# Altium project DD_Current_Sensing.PrjPcb
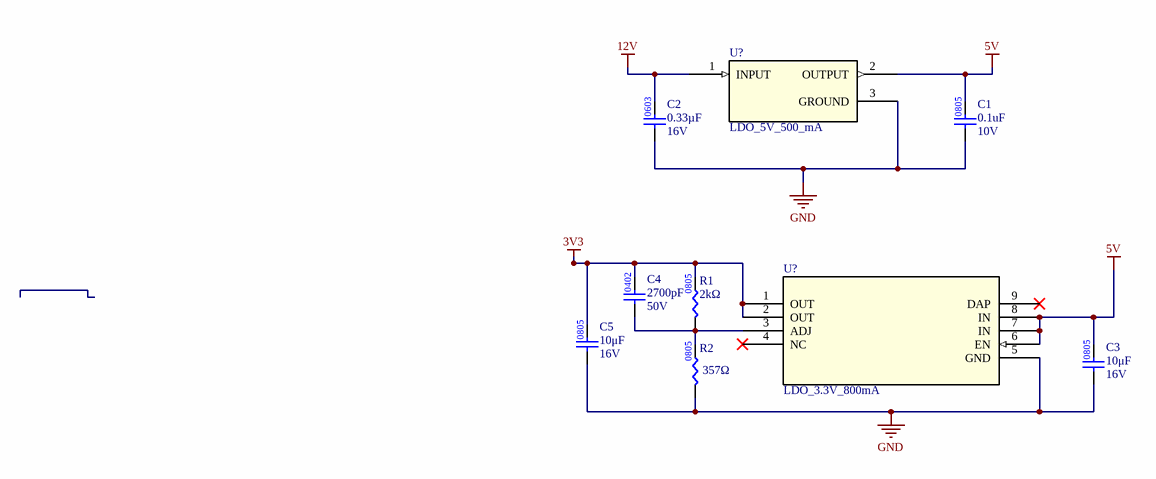
[diagram p0: PowerStepDown.SchDoc]
designer: Logan Hartford; reviewer: Ari Wasch; total sheets: 6; version: 6.0
2 sheets, 21 parts. Net scope: flat (ports and power ports of the same name join across sheets).
Sheets:
  PowerStepDown.SchDoc
  Power.SchDoc

## Sheet PowerStepDown.SchDoc
size 279 x 215 mm

### Parts
(Parts that share a designator on the sheet are numbered #1, #2 ... from top to bottom, then left to right.)
C1  value 0.1uF  Voltage Rating: 10V  [CAP0805]  (hidden comment: CAP_0.1uF_10V_0805)
C2  value 0.33µF  Voltage Rating: 16V  [CAP0603]  (hidden comment: CAP_0.33uF_16V_0603)
C3  value 10μF  Voltage Rating: 16V  [CAP0805]  (hidden comment: CAP_10uF_16V_0805)
C4  Capacitance: 2700pF  Voltage Rating: 50V  [CAP0402]  (hidden comment: CAP_2700pF_50V_0402)
C5  value 10μF  Voltage Rating: 16V  [CAP0805]  (hidden comment: CAP_10uF_16V_0805)
R1#1  value 2kΩ  [RES0805]  (hidden comment: RES_2KΩ_0805_1%)
R2#1  357Ω  [RES0805]
U?#1  LDO_5V_500_mA  [L78M05CDT-TR]
U?#2  LDO_3.3V_800mA  [LP38511MRX-ADJ/NOPB]

### Nets
3V3: C4.2 C5.2 R1#1.2 U?#2.1(OUT) U?#2.2(OUT)
5V: C1.2 C3.2 U?#1.2(OUTPUT) U?#2.6(EN) U?#2.7(IN) U?#2.8(IN)
12V: C2.2 U?#1.1(INPUT)
GND: C1.1 C2.1 C3.1 C5.1 R2#1.1 U?#1.3(GROUND) U?#2.5(GND)
NetC4_1: C4.1 R1#1.1 R2#1.2 U?#2.3(ADJ)

Not connected (* = marked no-connect by the designer): U?#2 4(NC)* 9(DAP)*

### Notes on the sheet
- University of Waterloo Robotics Team
- 200 University Ave W
- REV
- PROJECT
- Waterloo, Ontario, Canada
- N2L 3G1
- DOCUMENT
- ENGINEER
- REVIEWER
- MODIFIED
- SHEET
- OF
- (in symbol CAP_0.33uF_16V_0603) 0603
- (in symbol CAP_2700pF_50V_0402) 0402
- (in symbol RES_357Ω_0805_1%) 0805

### Library data of the parts
C1 = CAP_0.1uF_10V_0805: CAP CER 0.1uF 10V 0805; Manufacturer 1: KEMET; Manufacturer Part Number 1: C0805C104K8RAC7800; Package/Footprint: 0805; Supplier 1: Digi-Key; Supplier Part Number 1: 399-C0805C104K8RAC7800DKR-ND
C2 = CAP_0.33uF_16V_0603: CAP CER 0.33UF 16V X7R 0603; Manufacturer Part Number 1: GCM188R71C334KA37D; Manufacturer 1: Murata Electronics North America; Supplier Part Number 1: 490-6050-1-ND; Supplier 1: Digi-Key; Dielectric: X7R
C3 C5 = CAP_10uF_16V_0805: CAP CER 10UF 16V X5R 0805; Manufacturer 1: Yageo; Manufacturer Part Number 1: CC0805KKX5R7BB106; Package/Footprint: 0805; Mounting Type: SMD; Supplier 1: Digi-Key; Supplier Part Number 1: 311-1865-1-ND; Dielectric: X5R
C4 = CAP_2700pF_50V_0402: CAP CER 2700PF 50V C0G 0805; Manufacturer 1: TDK Corporation; Manufacturer Part Number 1: C2012C0G1H272J060AA; Package: 0805; Supplier 1: Digi-Key; Supplier Part Number 1: 445-7508-1-ND
R1#1 = RES_2KΩ_0805_1%: RES 2K OHM 1% 1/8W 0805; Manufacturer 1: YAGEO; Manufacturer Part Number 1: CRCW08052K20JNEAC; Supplier 1: Digi-Key; Supplier Part Number 1: 13-RC0805FR-132KLCT-ND; Tolerance: 1%; Package: 0805
R2#1 = RES_357Ω_0805_1%: RES 357K OHM 1% 1/16W 0805

## Sheet Power.SchDoc
size 279 x 215 mm
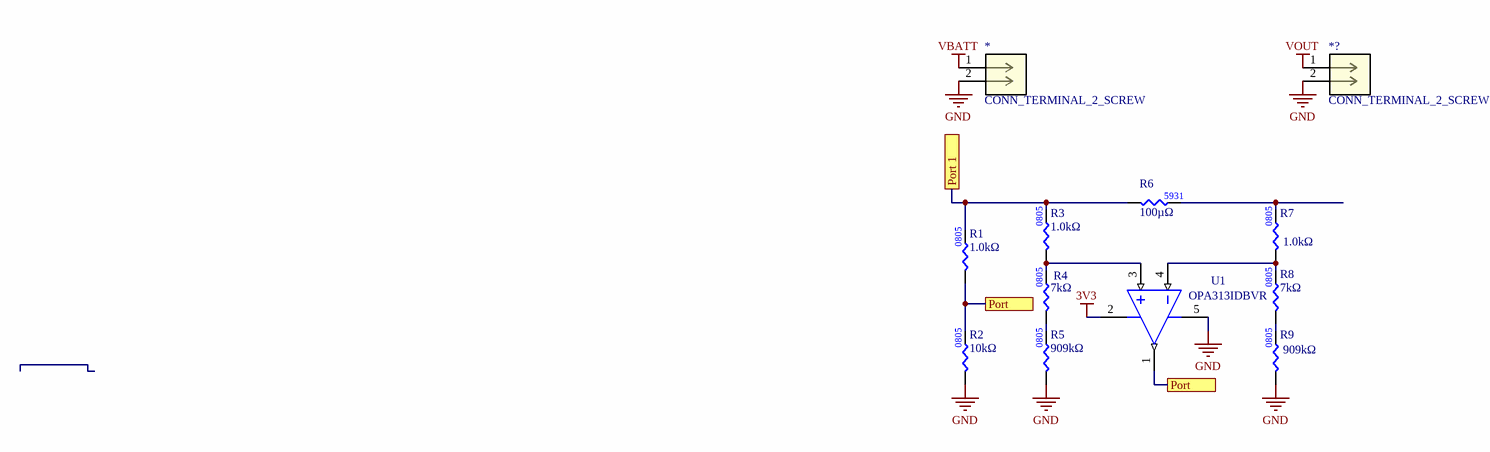
[diagram p1: Power.SchDoc]

### Parts
(Parts that share a designator on the sheet are numbered #1, #2 ... from top to bottom, then left to right.)
*  CONN_TERMINAL_2_SCREW  [Model Name]
*?  CONN_TERMINAL_2_SCREW  [Model Name]
R1#2  value 1.0kΩ  [RES0805]  (hidden comment: RES_1kΩ_0805_1%)
R2#2  value 10kΩ  [RES0805]  (hidden comment: RES_10kΩ_0805_5%)
R3  value 1.0kΩ  [RES0805]  (hidden comment: RES_1kΩ_0805_1%)
R4  value 7kΩ  [RES0805]  (hidden comment: RES_7kΩ_0805_0.1%)
R5  value 909kΩ  [RES0805]  (hidden comment: RES_909kΩ_0805_0.1%)
R6  value 100µΩ  [RES-5931]  (hidden comment: RES_100µΩ_5931_1%)
R7  value 1.0kΩ  [RES0805]  (hidden comment: RES_1kΩ_0805_1%)
R8  value 7kΩ  [RES0805]  (hidden comment: RES_7kΩ_0805_0.1%)
R9  value 909kΩ  [RES0805]  (hidden comment: RES_909kΩ_0805_0.1%)
U1  Manufacturer Part Number 1: OPA313IDBVR  [DBV0005A_M]  (hidden comment: OPAMP_OPA313IDBVR)

### Ports
Port, Port 1

### Nets
3V3: U1.2(V-)
GND: *.2 *?.2 R2#2.1 R5.1 R9.1 U1.5(V+)
VBATT: *.1
VOUT: *?.1
NetR1#2_1: R1#2.1 R2#2.2 U1.1(OUT) ; port Port
NetR1#2_2: R1#2.2 R3.2 R6.1 ; port Port 1
NetR3_1: R3.1 R4.2 U1.3(IN+)
NetR4_1: R4.1 R5.2
NetR6_2: R6.2 R7.2
NetR7_1: R7.1 R8.2 U1.4(IN-)
NetR8_1: R8.1 R9.2

### Notes on the sheet
- University of Waterloo Robotics Team
- 200 University Ave W
- REV
- PROJECT
- Waterloo, Ontario, Canada
- N2L 3G1
- DOCUMENT
- ENGINEER
- REVIEWER
- MODIFIED
- SHEET
- OF
- (in symbol RES_100µΩ_5931_1%) 5931

### Library data of the parts
R1#2 R3 R7 = RES_1kΩ_0805_1%: RES 1K OHM 1% 1/8W 0805; Manufacturer 1: Yageo; Manufacturer Part Number 1: RC0805FR-071K07L; Supplier 1: Digi-Key; Mounting Type: SMD; Supplier Part Number 1: 311-1.07KCRCT-ND; Package: 0805
R2#2 = RES_10kΩ_0805_5%: RES 10K OHM 5% 1/8W 0805; Manufacturer 1: Panasonic Electronic Components; Manufacturer Part Number 1: ERJ-6GEYJ103V; Package/Footprint: 0805; Supplier 1: Digi-Key; Supplier Part Number 1: P10KACT-ND; LCSC Part #: C17414; Mounting Type: SMD
R4 R8 = RES_7kΩ_0805_0.1%: RES 7K OHM 0.1% 1/5W 0805; Manufacturer 1: Panasonic Electronic Components; Manufacturer Part Number 1: ERJ-6GEYJ103V; Package/Footprint: 0805; Supplier 1: Digi-Key; Supplier Part Number 1: P10KACT-ND; LCSC Part #: C17414; Mounting Type: SMD
R5 R9 = RES_909kΩ_0805_0.1%: RES 909K OHM 0.1% 5/8W 0805; Manufacturer 1: Panasonic Electronic Components; Manufacturer Part Number 1: ERJ-6GEYJ103V; Package/Footprint: 0805; Supplier 1: Digi-Key; Supplier Part Number 1: P10KACT-ND; LCSC Part #: C17414; Mounting Type: SMD
R6 = RES_100µΩ_5931_1%: RES 100µ OHM 1% 15W 5931; Manufacturer 1: Panasonic Electronic Components; Manufacturer Part Number 1: ERJ-6GEYJ103V; Part Number: 13-PU5931FKIPB0U1LTR-ND; Package/Footprint: 0805; LCSC Part #: C17414; Mounting Type: SMD; Power: 15W; Supplier 1: DigiKey; Supplier Part Number 1: P10KACT-ND; Supplier 2: Digikey; Supplier Part Number 2: 13-PU5931FKIPB0U1LCT-ND
U1 = OPAMP_OPA313IDBVR: IC OPAMP GP 1 CIRCUIT SOT23-5; Manufacturer 1: Texas Instruments; Package: SOT-23-5; Mounting Type: SMD; Supplier Part Number 1: 296-35607-1-ND; Supplier 1: Digi-Key; Verified: No
* *? = CONN_TERMINAL_2_SCREW: ComponentLink1Description: New link; ComponentLink1URL: https://www.digikey.ca/en/products/detail/phoenix-contact/1935161/568614

## Nets that join several sheets
3V3: PowerStepDown (5 pins), Power (U1.2)
GND: PowerStepDown (7 pins), Power (6 pins)

## Assembly variants
Only Populated Components: all parts fitted